# EAGLE design mimic4688 (EAGLE 7.5.0)
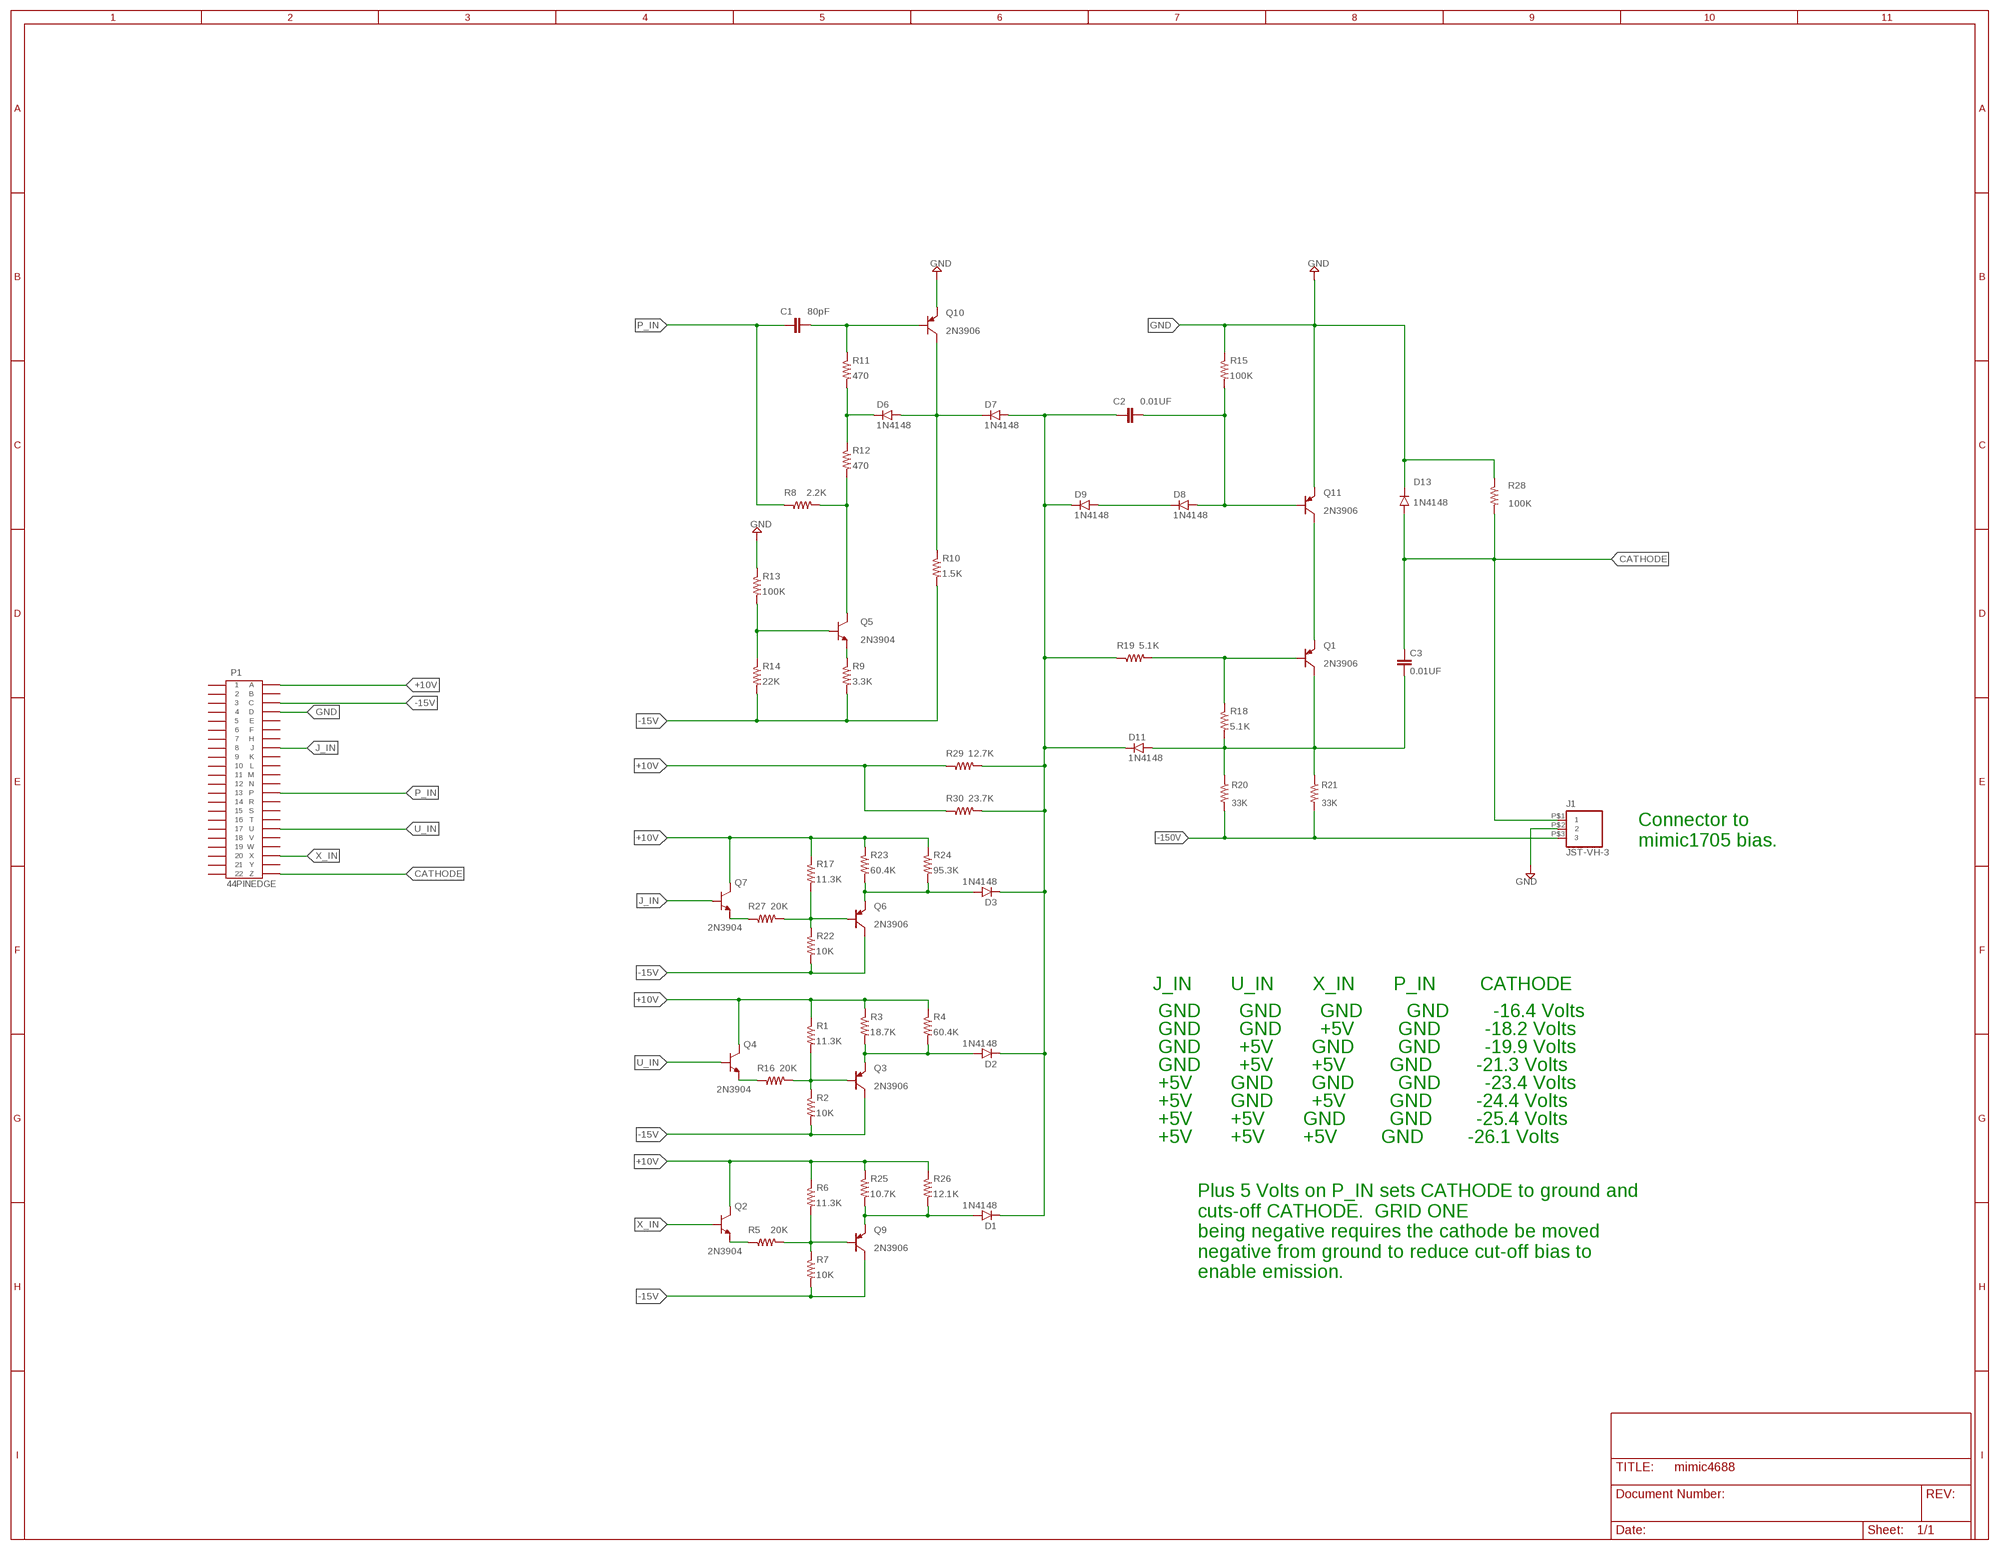
[diagram p0: schematic, sheet 1]

## Parts
C1  80pF  CAP_5MM  [5MM_TH]
C2  0.01UF  CAP_5MM  [5MM_TH]
C3  0.01UF  CAP_5MM  [5MM_TH]
D1  1N4148  [DO35-7]
D2  1N4148  [DO35-7]
D3  1N4148  [DO35-7]
D6  1N4148  [DO35-7]
D7  1N4148  [DO35-7]
D8  1N4148  [DO35-7]
D9  1N4148  [DO35-7]
D11  1N4148  [DO35-7]
D13  1N4148  [DO35-7]
J1  JST-VH-3  [VHR-3N]
P1  44PINEDGE  [44PINEDGE]
Q1  2N3906  [TO92]
Q2  2N3904  [TO92]
Q3  2N3906  [TO92]
Q4  2N3904  [TO92]
Q5  2N3904  [TO92]
Q6  2N3906  [TO92]
Q7  2N3904  [TO92]
Q9  2N3906  [TO92]
Q10  2N3906  [TO92]
Q11  2N3906  [TO92]
R1  11.3K  R-1/4WATT  [0207/10]
R2  10K  R-1/4WATT  [0207/10]
R3  18.7K  R-1/4WATT  [0207/10]
R4  60.4K  R-1/4WATT  [0207/10]
R5  20K  R-1/4WATT  [0207/10]
R6  11.3K  R-1/4WATT  [0207/10]
R7  10K  R-1/4WATT  [0207/10]
R8  2.2K  R-1/4WATT  [0207/10]
R9  3.3K  R-1/4WATT  [0207/10]
R10  1.5K  R-1/4WATT  [0207/10]
R11  470  R-1/4WATT  [0207/10]
R12  470  R-1/4WATT  [0207/10]
R13  100K  R-1/4WATT  [0207/10]
R14  22K  R-1/4WATT  [0207/10]
R15  100K  R-1/4WATT  [0207/10]
R16  20K  R-1/4WATT  [0207/10]
R17  11.3K  R-1/4WATT  [0207/10]
R18  5.1K  R-1/4WATT  [0207/10]
R19  5.1K  R-1/4WATT  [0207/10]
R20  33K  RES33K2W  [RR02]
R21  33K  RES33K2W  [RR02]
R22  10K  R-1/4WATT  [0207/10]
R23  60.4K  R-1/4WATT  [0207/10]
R24  95.3K  R-1/4WATT  [0207/10]
R25  10.7K  R-1/4WATT  [0207/10]
R26  12.1K  R-1/4WATT  [0207/10]
R27  20K  R-1/4WATT  [0207/10]
R28  100K  R-1/4WATT  [0207/10]
R29  12.7K  R-1/4WATT  [0207/10]
R30  23.7K  R-1/4WATT  [0207/10]

## Nets
+10V: P1.A Q2.3(C) Q4.3(C) Q7.3(C) R1.1 R3.1 R4.1 R6.1 R17.1 R23.1 R24.1 R25.1 R26.1 R29.1 R30.1
-15V: P1.C Q3.1(C) Q6.1(C) Q9.1(C) R2.2 R7.2 R9.2 R10.2 R14.2 R22.2
-150V: J1.P$3 R20.2 R21.2
CATHODE: C3.1 D13.A J1.P$1 P1.Z R28.2
GND: D13.C J1.P$2 P1.D Q10.3(E) Q11.3(E) R13.1 R15.1 R28.1
J_IN: P1.J Q7.2(B)
N$1: C1.2 Q10.2(B) R11.1
N$2: Q3.2(B) R1.2 R2.1 R16.2
N$3: D2.A Q3.3(E) R3.2 R4.2
N$5: Q9.2(B) R5.2 R6.2 R7.1
N$6: Q2.1(E) R5.1
N$7: D6.A D7.C Q10.1(C) R10.1
N$8: D6.C R11.2 R12.1
N$9: Q5.3(C) R8.2 R12.2
N$10: Q4.1(E) R16.1
N$11: Q5.1(E) R9.1
N$12: Q5.2(B) R13.2 R14.1
N$13: Q6.2(B) R17.2 R22.1 R27.2
N$14: D8.C D9.A
N$15: Q1.3(E) Q11.1(C)
N$16: D3.A Q6.3(E) R23.2 R24.2
N$17: D1.A Q9.3(E) R25.2 R26.2
N$18: Q1.2(B) R18.1 R19.2
N$20: C2.2 D8.A Q11.2(B) R15.2
N$21: C2.1 D1.C D2.C D3.C D7.A D9.C D11.C R19.1 R29.2 R30.2
N$22: Q7.1(E) R27.1
P_IN: C1.1 P1.P R8.1
U_IN: P1.U Q4.2(B)
X_IN: P1.X Q2.2(B)
Y_OUT: C3.2 D11.A Q1.1(C) R18.2 R20.1 R21.1
Unconnected: P1.1 P1.2 P1.3 P1.4 P1.5 P1.6 P1.7 P1.8 P1.9 P1.10 P1.11 P1.12 P1.13 P1.14 P1.15 P1.16 P1.17 P1.18 P1.19 P1.20 P1.21 P1.22 P1.B P1.E P1.F P1.H P1.K P1.L P1.M P1.N P1.R P1.S P1.T P1.V P1.W P1.Y

## Notes on the sheet
- Connector to 
  mimic1705 bias.
- J_IN       U_IN       X_IN       P_IN        CATHODE
- GND       GND       GND        GND        -16.4 Volts
- GND       GND       +5V        GND        -18.2 Volts
- GND       +5V       GND        GND        -19.9 Volts
- GND       +5V       +5V        GND        -21.3 Volts
- +5V       GND       GND        GND        -23.4 Volts
- +5V       GND       +5V        GND        -24.4 Volts
- +5V       +5V       GND        GND        -25.4 Volts
- +5V       +5V       +5V        GND        -26.1 Volts
- Plus 5 Volts on P_IN sets CATHODE to ground and
  cuts-off CATHODE.  GRID ONE 
  being negative requires the cathode be moved
  negative from ground to reduce cut-off bias to 
  enable emission.

## Library data of the parts
C1-C3 = keiths:CAP_5MM: Through hole radial, 5m pin spacing.
D1-D3 D6-D9 D11 D13 = keiths:1N4148: High Conductance Fast Diode
J1 = keiths:JST-VH-3: JST CONN HEADER VH SIDE 3POS 3.96MM
P1 = keiths:44PINEDGE: 44 PIN EDGE CONNECTOR FOR PCB
Q1 Q3 Q6 Q9-Q11 = keiths:2N3906: PNP Transistor
Q2 Q4 Q5 Q7 = keiths:2N3904: NPN Transistor
R1-R19 R22-R30 = keiths:R-1/4WATT: Quarter watt through hole resistor.
R20 R21 = keiths:RES33K2W: Metal Film Resistors - Through Hole 5% 33K TE Connectivity RR02J33KTB

## Board
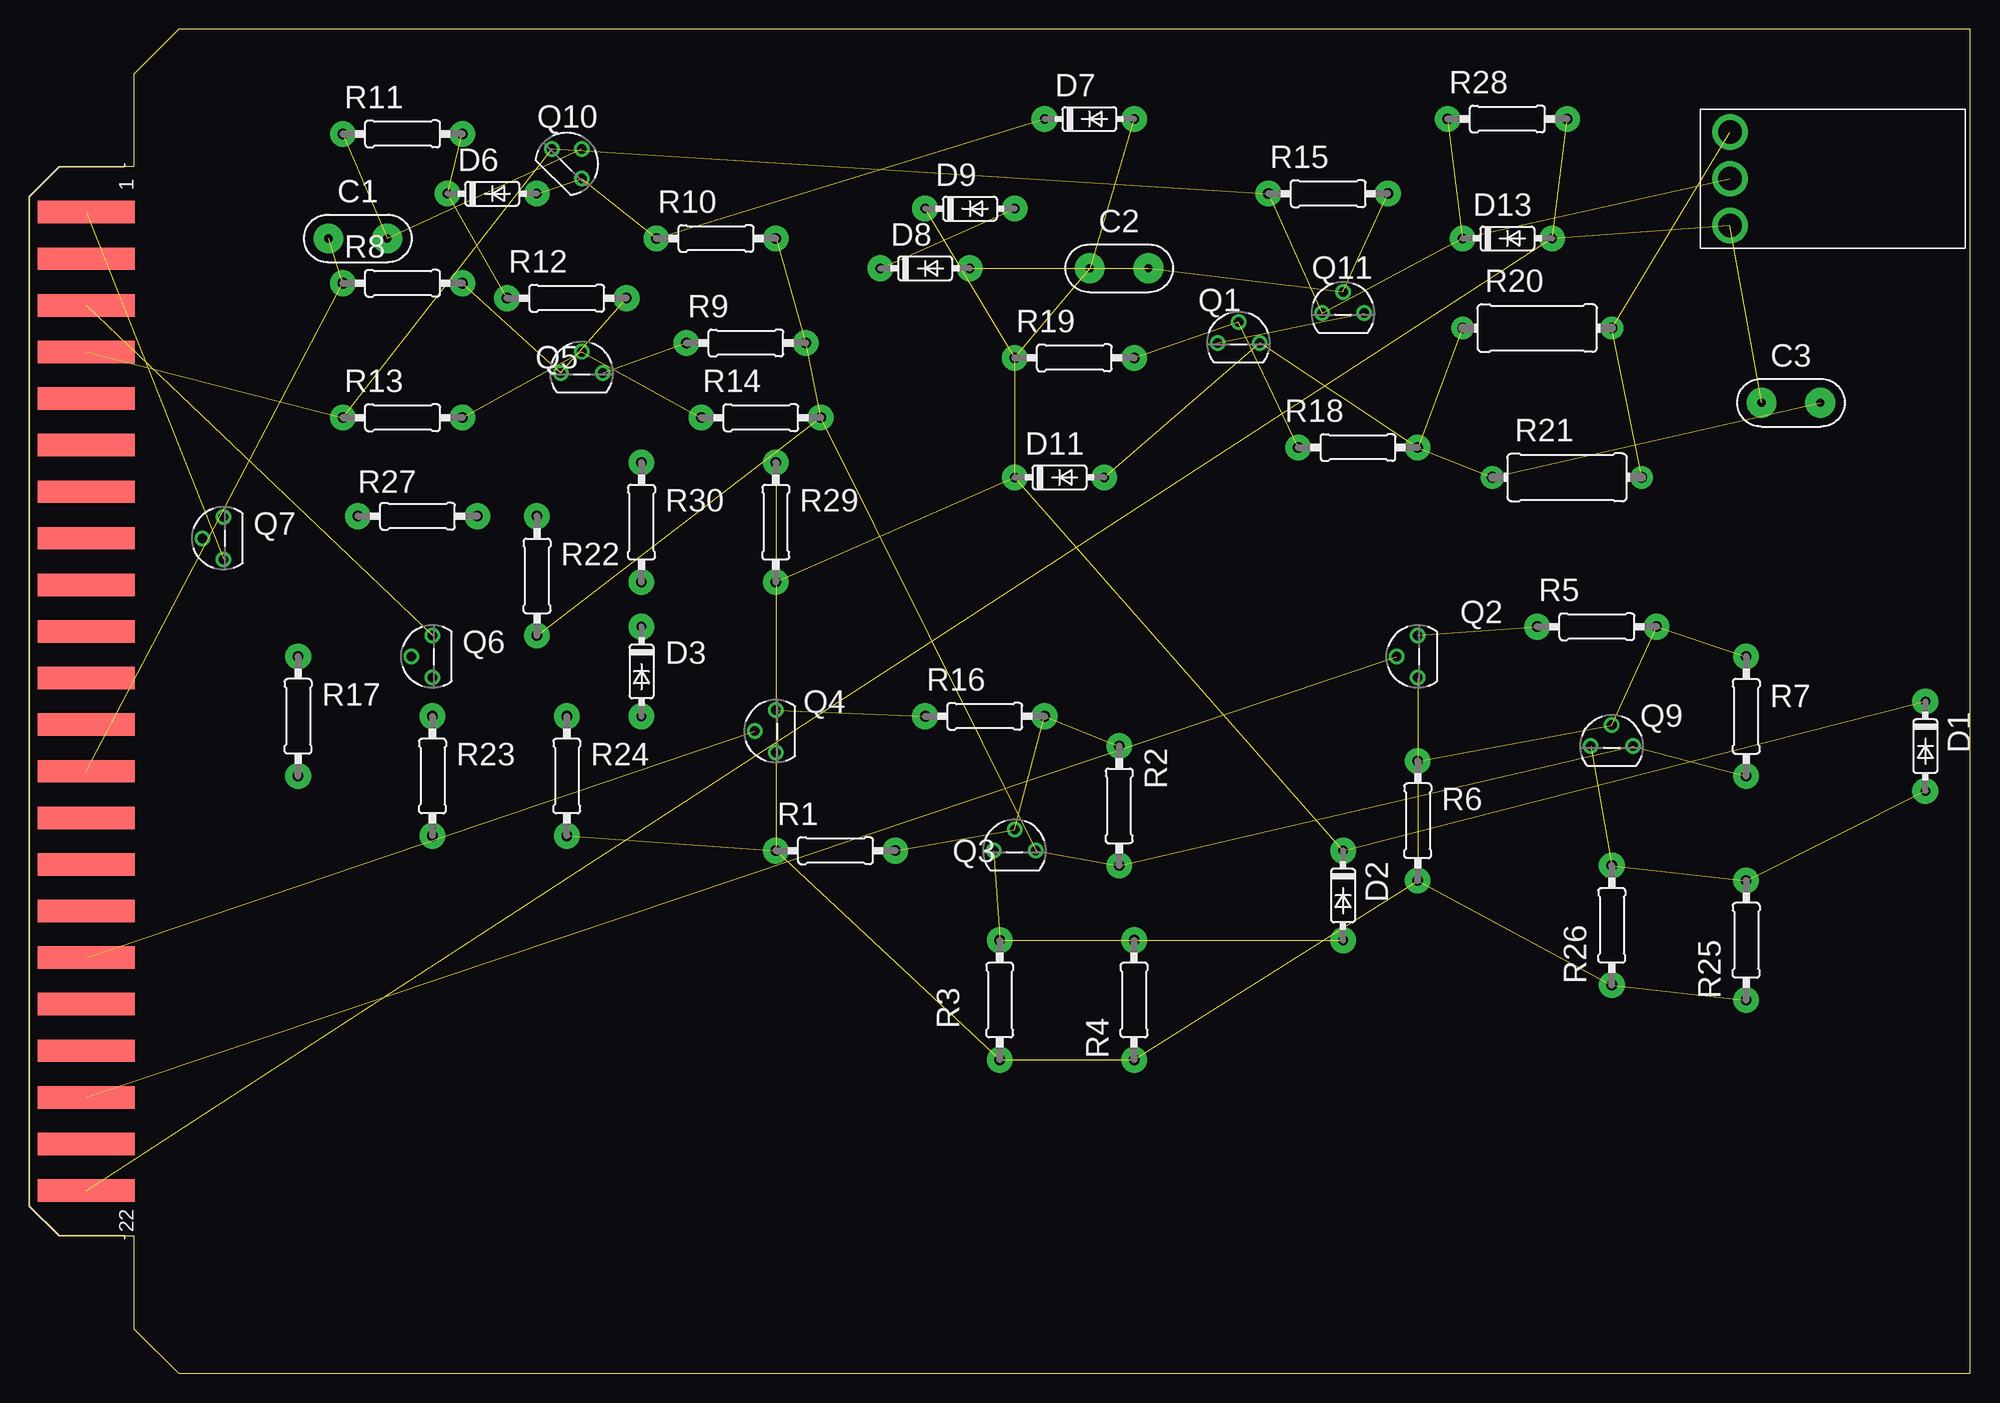
[diagram p1: board, top side]
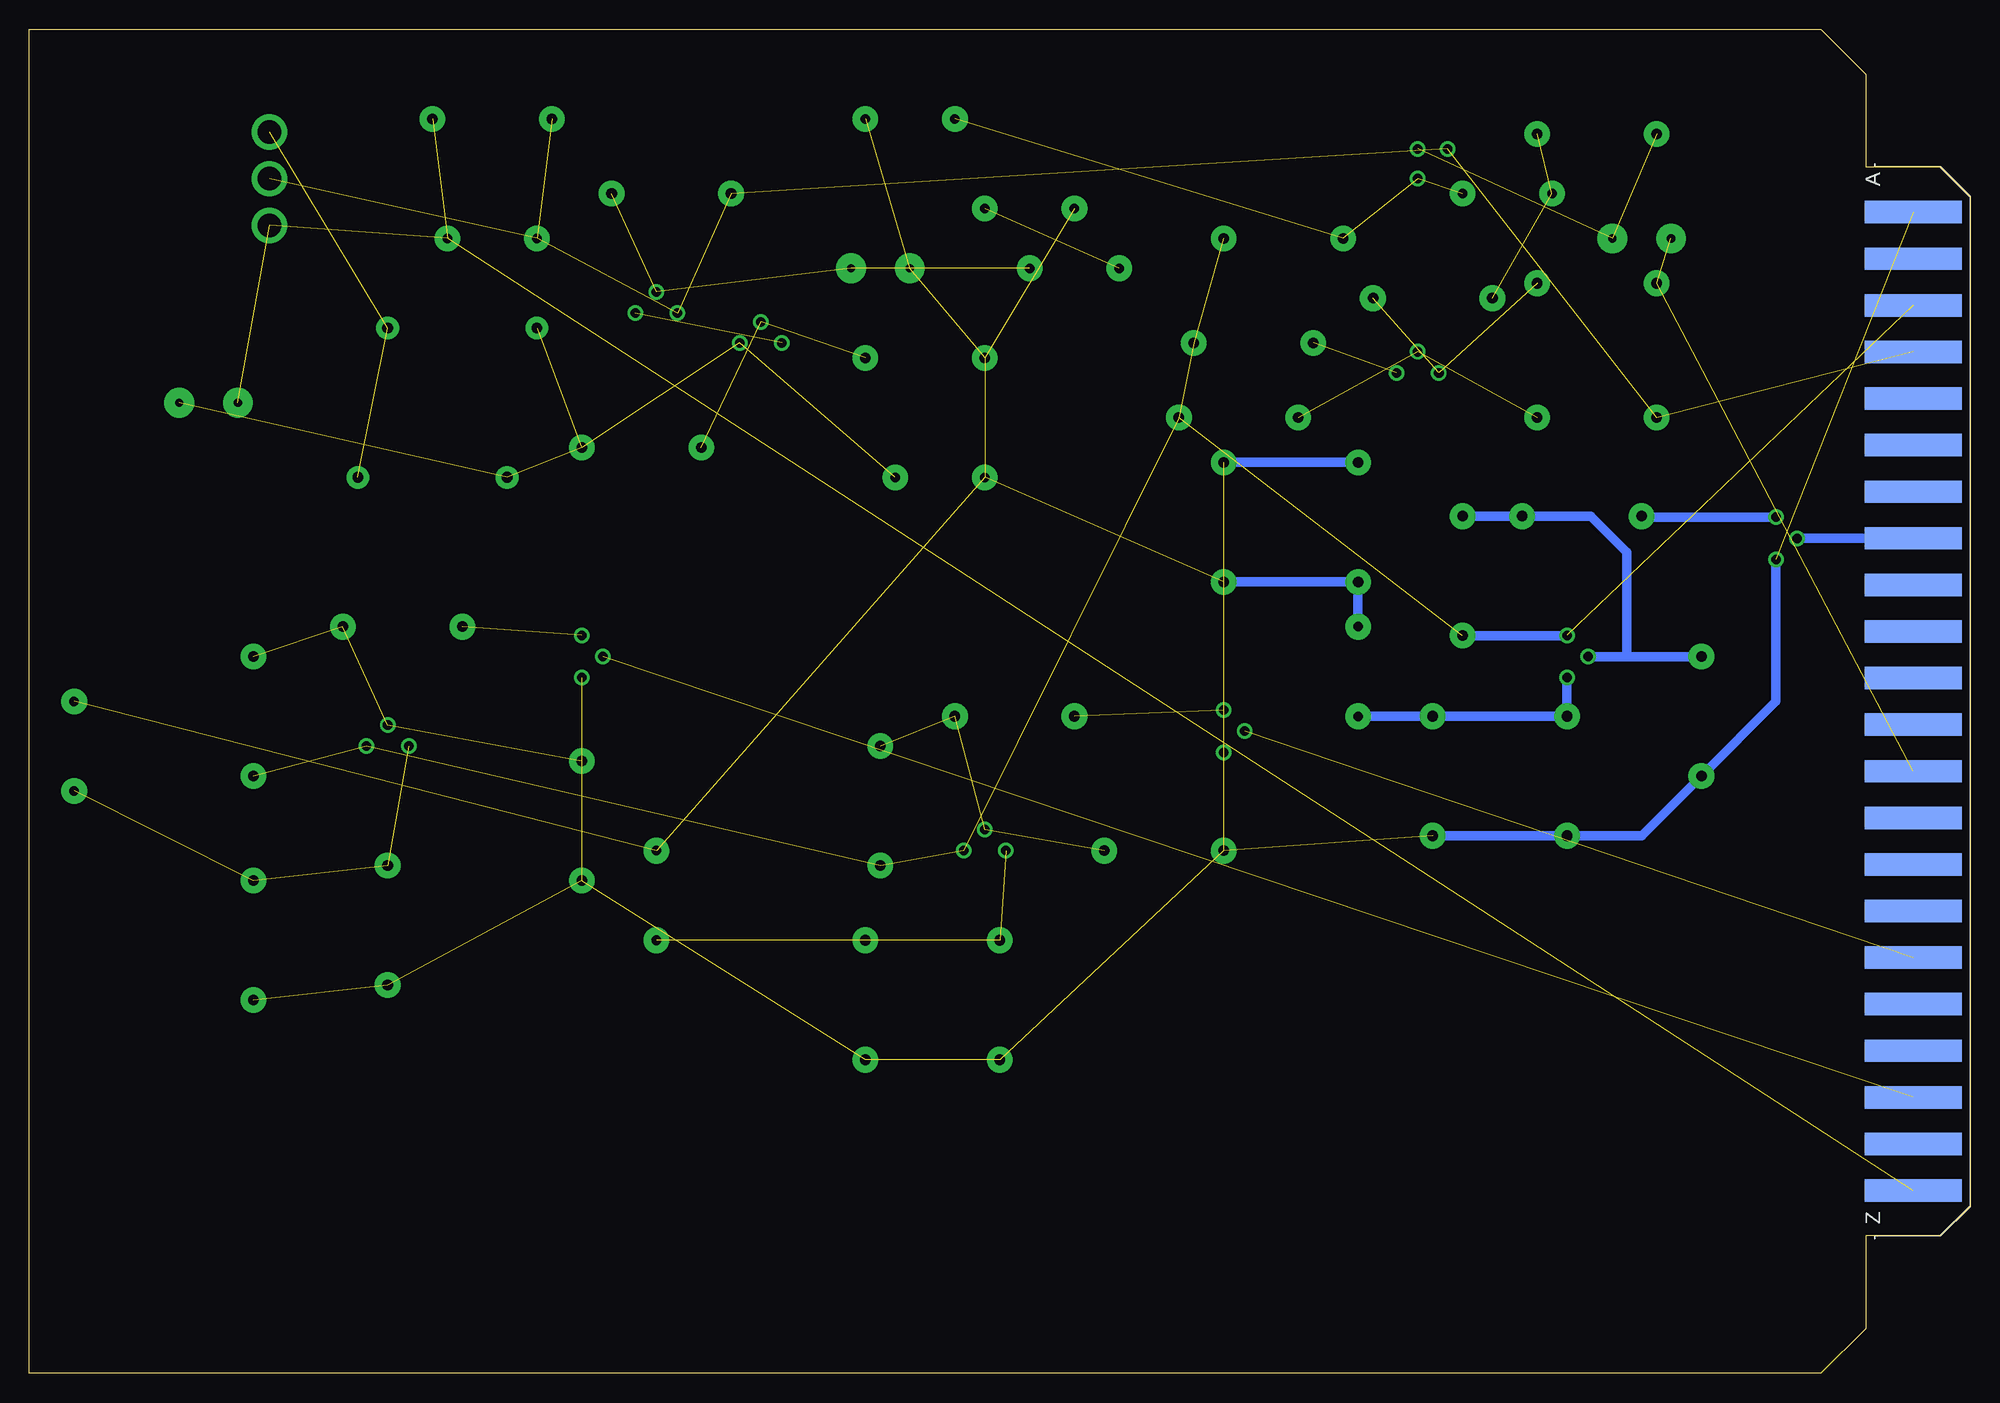
[diagram p2: board, bottom side, seen from below]

Size 165.1 x 114.3 mm. Coordinates in mm from the lower left corner, seen from the top.
Outline: 2.54,11.68 8.89,11.68 8.89,3.81 12.7,0 165.1,0 165.1,114.3 12.7,114.3 8.89,110.49 8.89,102.62 2.54,102.62 0,100.08 0,14.22 2.54,11.68
Copper layers (1*16): Top 0.035mm / dielectric 1.5mm / Bottom 0.035mm
Design rules "default": minimum track width 10mil, minimum drill 24mil, track to track 8mil, track to pad 8mil, pad to pad 8mil, via to via 8mil, smd to smd 8mil, copper to edge 40mil, drill to drill 8mil, minimum pad ring 10mil, minimum via ring 8mil, stop-mask expansion 4mil, vias tented up to drill 0mil, thermal gap 10mil

### Footprints (pad centres in the part's own frame; a part is rotated, then mirrored left to right if it is on the bottom)
5MM_TH = drill 0.7 pad 2.54: 1 -2.5,0; 2 2.5,0
DO35-7 = drill 0.813 pad 2.184: A 3.81,0; C -3.81,0
VHR-3N = drill 2: P$1 -9,-3.969; P$2 -9,0; P$3 -9,3.969
44PINEDGE = smd 1.905 x 8.255: 1 -41.605,4.826; 2 -37.643,4.826; 3 -33.68,4.826; 4 -29.718,4.826; 5 -25.756,4.826; 6 -21.793,4.826; 7 -17.831,4.826; 8 -13.868,4.826; 9 -9.906,4.826; 10 -5.944,4.826; 11 -1.981,4.826; 12 1.981,4.826; 13 5.944,4.826; 14 9.906,4.826; 15 13.868,4.826; 16 17.831,4.826; 17 21.793,4.826; 18 25.756,4.826; 19 29.718,4.826; 20 33.68,4.826; 21 37.643,4.826; 22 41.605,4.826 | smd 1.905 x 8.255 bottom: A -41.605,4.826; B -37.643,4.826; C -33.68,4.826; D -29.718,4.826; E -25.756,4.826; F -21.793,4.826; H -17.831,4.826; J -13.868,4.826; K -9.906,4.826; L -5.944,4.826; M -1.981,4.826; N 1.981,4.826; P 5.944,4.826; R 9.906,4.826; S 13.868,4.826; T 17.831,4.826; U 21.793,4.826; V 25.756,4.826; W 29.718,4.826; X 33.68,4.826; Y 37.643,4.826; Z 41.605,4.826
TO92 = drill 0.813: 1 1.27,-1.27; 2 1.27,1.27; 3 -1.27,1.27
0207/10 = drill 0.9 pad 2.184: 1 -5.08,0; 2 5.08,0
RR02 = drill 0.914 pad 1.93: 1 -6.35,0; 2 6.35,0

### Placement (x,y rotation side)
C1  27.94,96.52 0 top
C2  92.71,93.98 0 top
C3  149.86,82.55 0 top
D1  161.29,53.34 270 top
D2  111.76,40.64 270 top
D3  52.07,59.69 270 top
D6  39.37,100.33 0 top
D7  90.17,106.68 0 top
D8  76.2,93.98 0 top
D9  80.01,99.06 0 top
D11  87.63,76.2 0 top
D13  125.73,96.52 0 top
J1  153.67,101.6 0 top
P1  0,57.15 270 top
Q1  102.87,87.63 45 top
Q2  118.11,60.96 135 top
Q3  83.82,44.45 45 top
Q4  63.5,54.61 135 top
Q5  46.99,85.09 45 top
Q6  34.29,60.96 135 top
Q7  16.51,71.02 135 top
Q9  134.62,53.34 45 top
Q10  45.72,102.87 0 top
Q11  111.76,90.17 45 top
R1  68.58,44.45 0 top
R2  92.71,48.26 270 top
R3  82.55,31.75 90 top
R4  93.98,31.75 90 top
R5  133.35,63.5 0 top
R6  118.11,46.99 90 top
R7  146.05,55.88 270 top
R8  31.75,92.71 0 top
R9  60.96,87.63 0 top
R10  58.42,96.52 0 top
R11  31.75,105.41 0 top
R12  45.72,91.44 0 top
R13  31.75,81.28 0 top
R14  62.23,81.28 0 top
R15  110.49,100.33 0 top
R16  81.28,55.88 0 top
R17  22.86,55.88 90 top
R18  113.03,78.74 0 top
R19  88.9,86.36 0 top
R20  128.27,88.9 0 top
R21  130.81,76.2 0 top
R22  43.18,67.82 270 top
R23  34.29,50.8 90 top
R24  45.72,50.8 90 top
R25  146.05,36.83 90 top
R26  134.62,38.1 90 top
R27  33.02,72.9 0 top
R28  125.73,106.68 0 top
R29  63.5,72.39 270 top
R30  52.07,72.39 270 top

### Tracks (layer width: path | path; a pad name or v marks a point on that pad's centre or on a via)
+10V  (10 unrouted)
  Bottom 0.813: R24.1 R23.1 27.94,45.72 R17.1 16.51,57.15 Q7.3 | R30.1 R29.1
-15V  (8 unrouted)
  Bottom 0.813: R22.2 34.29,62.74 Q6.1
-150V  (2 unrouted)
CATHODE  (4 unrouted)
GND  (7 unrouted)
J_IN
  Bottom 0.813: P1.J Q7.2
N$1  (2 unrouted)
N$2  (3 unrouted)
N$3  (3 unrouted)
N$5  (3 unrouted)
N$6  (1 unrouted)
N$7  (3 unrouted)
N$8  (2 unrouted)
N$9  (2 unrouted)
N$10  (1 unrouted)
N$11  (1 unrouted)
N$12  (2 unrouted)
N$13
  Bottom 0.813: R22.1 R27.2 32.26,72.9 29.21,69.85 29.21,60.96 | R17.2 29.21,60.96 | 29.21,60.96 Q6.2
N$14  (1 unrouted)
N$15  (1 unrouted)
N$16
  Bottom 0.813: Q6.3 R23.2 R24.2 D3.A
N$17  (3 unrouted)
N$18  (2 unrouted)
N$20  (3 unrouted)
N$21  (7 unrouted)
  Bottom 0.813: R29.2 R30.2 D3.C
N$22
  Bottom 0.813: Q7.1 27.94,72.81 R27.1
P_IN  (2 unrouted)
U_IN  (1 unrouted)
X_IN  (1 unrouted)
Y_OUT  (5 unrouted)